# Altium schematic sheet STM32F103C8T6.SchDoc
size A4; SheetNumber: 1; SheetTotal: 1
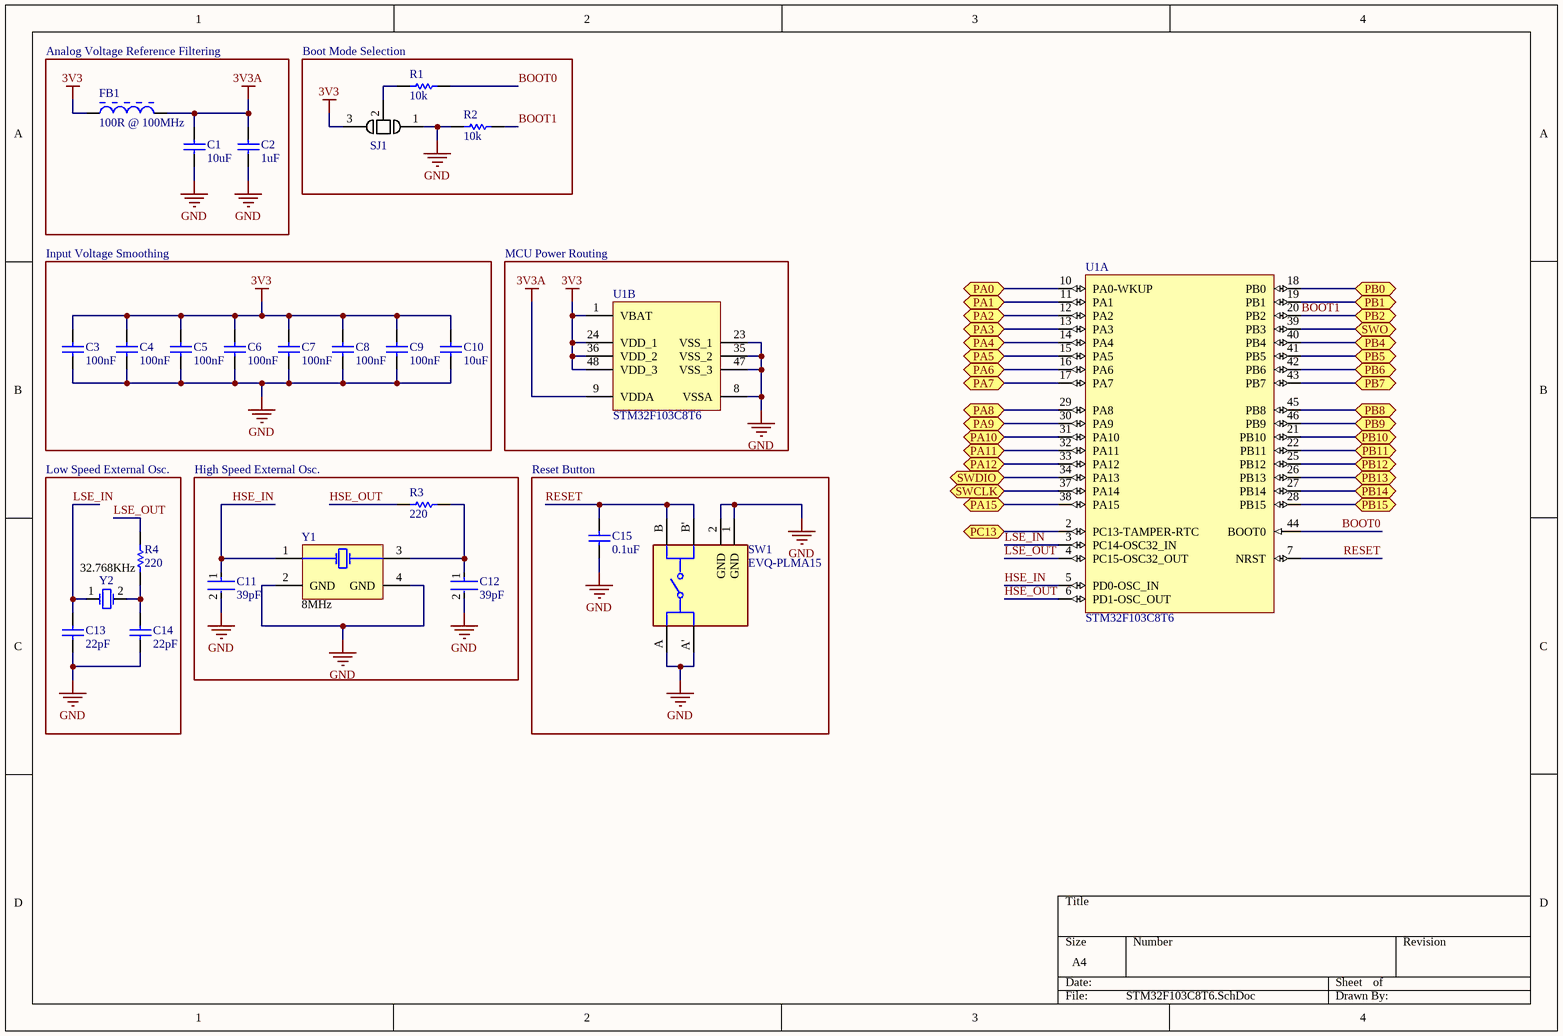
[diagram p0: STM32F103C8T6.SchDoc]

## Parts
C1  10uF  [CAPC3216X180X50LL20T30]
C2  1uF  [CAPC2013X140X50NL20T25]
C3  100nF  [CAPC2013X94X50LL20T25]
C4  100nF  [CAPC2013X94X50LL20T25]
C5  100nF  [CAPC2013X94X50LL20T25]
C6  100nF  [CAPC2013X94X50LL20T25]
C7  100nF  [CAPC2013X94X50LL20T25]
C8  100nF  [CAPC2013X94X50LL20T25]
C9  100nF  [CAPC2013X94X50LL20T25]
C10  10uF  [CAPC3216X180X50LL20T30]
C11  39pF  [FP-CL21-IPC_B]
C12  39pF  [FP-CL21-IPC_B]
C13  22pF  [CAPC2012X88X50ML20T25]
C14  22pF  [CAPC2012X88X50ML20T25]
C15  0.1uF  [CAPC2013X95X45ML10T25]
FB1  100R @ 100MHz  [MURA-BLM18PG_KG-B25-CHIP-2_V1]
R1  10k  [RESC2013X70X40LL20T20]
R2  10k  [RESC2013X70X40LL20T20]
R3  220  [RESC2013X70X40NL20T20]
R4  220  [RESC2013X70X40NL20T20]
SJ1  Switchable Jumper  [6mil Switchable]  (value not drawn)
SW1  EVQ-PLMA15  [FP-EVQ-PLMA15-MFG]
U1  STM32F103C8T6  [STM-LQFP48_L]  (parts A,B of 2)
Y1  8MHz  [ABRA-ABM3B_V]
Y2  32.768KHz  [CMHT-CM315D-2_V]

## Blocks framed on the sheet
Analog Voltage Reference Filtering: C1 C2 FB1
Boot Mode Selection: R1 R2 SJ1
Input Voltage Smoothing: C3-C10
MCU Power Routing: U1
Low Speed External Osc.: C13 C14 R4 Y2
High Speed External Osc.: C11 C12 R3 Y1
Reset Button: C15 SW1

## Ports
PA0 (bidir), PA1 (bidir), PA2 (bidir), PA3 (bidir), PA4 (bidir), PA5 (bidir), PA6 (bidir), PA7 (bidir), PA8 (bidir), PA9 (bidir), PA10 (bidir), PA11 (bidir), PA12 (bidir), PA15 (bidir), PB0 (bidir), PB1 (bidir), PB2 (bidir), PB4 (bidir), PB5 (bidir), PB6 (bidir), PB7 (bidir), PB8 (bidir), PB9 (bidir), PB10 (bidir), PB11 (bidir), PB12 (bidir), PB13 (bidir), PB14 (bidir), PB15 (bidir), PC13 (bidir), SWCLK (bidir), SWDIO (bidir), SWO (bidir)

## Nets
3V3: C3.2 C4.2 C5.2 C6.2 C7.2 C8.2 C9.2 C10.2 FB1.1 SJ1.3 U1.1(VBAT) U1.24(VDD_1) U1.36(VDD_2) U1.48(VDD_3)
3V3A: C1.2 C2.2 FB1.2 U1.9(VDDA)
GND: C1.1 C2.1 C3.1 C4.1 C5.1 C6.1 C7.1 C8.1 C9.1 C10.1 C11.2 C12.2 C13.1 C14.1 C15.2 R2.1 SJ1.1 SW1.1(GND) SW1.2(GND) SW1.A SW1.A' U1.8(VSSA) U1.23(VSS_1) U1.35(VSS_2) U1.47(VSS_3) Y1.2(GND) Y1.4(GND)
BOOT0: R1.2 U1.44(BOOT0)
BOOT1: R2.2 U1.20(PB2) ; port PB2
HSE_IN: C11.1 U1.5(PD0-OSC_IN) Y1.1(X1)
HSE_OUT: R3.2 U1.6(PD1-OSC_OUT)
LSE_IN: C13.2 U1.3(PC14-OSC32_IN) Y2.1
LSE_OUT: R4.2 U1.4(PC15-OSC32_OUT)
PA0: U1.10(PA0-WKUP) ; port PA0
PA1: U1.11(PA1) ; port PA1
PA2: U1.12(PA2) ; port PA2
PA3: U1.13(PA3) ; port PA3
PA4: U1.14(PA4) ; port PA4
PA5: U1.15(PA5) ; port PA5
PA6: U1.16(PA6) ; port PA6
PA7: U1.17(PA7) ; port PA7
PA8: U1.29(PA8) ; port PA8
PA9: U1.30(PA9) ; port PA9
PA10: U1.31(PA10) ; port PA10
PA11: U1.32(PA11) ; port PA11
PA12: U1.33(PA12) ; port PA12
PA15: U1.38(PA15) ; port PA15
PB0: U1.18(PB0) ; port PB0
PB1: U1.19(PB1) ; port PB1
PB4: U1.40(PB4) ; port PB4
PB5: U1.41(PB5) ; port PB5
PB6: U1.42(PB6) ; port PB6
PB7: U1.43(PB7) ; port PB7
PB8: U1.45(PB8) ; port PB8
PB9: U1.46(PB9) ; port PB9
PB10: U1.21(PB10) ; port PB10
PB11: U1.22(PB11) ; port PB11
PB12: U1.25(PB12) ; port PB12
PB13: U1.26(PB13) ; port PB13
PB14: U1.27(PB14) ; port PB14
PB15: U1.28(PB15) ; port PB15
PC13: U1.2(PC13-TAMPER-RTC) ; port PC13
RESET: C15.1 SW1.B SW1.B' U1.7(NRST)
SWCLK: U1.37(PA14) ; port SWCLK
SWDIO: U1.34(PA13) ; port SWDIO
SWO: U1.39(PB3) ; port SWO
NetC12_1: C12.1 R3.1 Y1.3(X2)
NetC14_2: C14.2 R4.1 Y2.2
NetR1_1: R1.1 SJ1.2

## Library data of the parts
C1 C10 = CMP-2000-06107-1: Chip Capacitor, 10 uF, +/- 10%, 25 V, -55 to 85 degC, 1206 (3216 Metric), RoHS, Tape and Reel; Manufacturer: Samsung Electro-Mechanics; Manufacturer Part Number: CL31A106KAHNNNE; Rated Voltage: 25V; Capacitance: 10µF; Dielectric: X5R; Material: Ceramic; Package Reference: 1206; Mounting Technology: SurfaceMount; Package Description: 2-Pin Surface Mount Device, Body 3.2 x 1.6 mm; Manufacturer URL: http://www.samsungsem.com/global/index.jsp; Case Size/Dimension: 1206; Datasheet URL: https://datasheet.ciiva.com/29201/452519-da-01-en-vs-kondensator-1206-29201124.pdf; Tolerance (%): ±10%; Datasheet Version: 11/2010; Supplier 1: Digi-Key; Supplier Part Number 1: 1276-1075-1-ND; RoHS: Yes; Category: Ceramic Capacitors; Stock 1: 396277; Pricing 1: 1=0.24000, 10=0.16500, 100=0.08360, 500=0.05720, 1000=0.05060 (USD); Mount: Surface Mount; Case/Package: 1206; Case Code (Metric): 3216; Case Code (Imperial): 1206; Contact Plating: Tin; Min Operating Temperature: -55°C; Max Operating Temperature: 85°C; Tolerance: 10%; Packaging: Tape and Reel; Voltage Rating (DC): 25V; Voltage Rating: 25V; Voltage: 25V; Length: 3.2mm; Height: 1.6mm; Width: 0.063inch; Depth: 1.6mm; Thickness: 0.071inch; Radiation Hardening: No; Lead Free: Lead Free; ComponentLink1URL: https://datasheet.ciiva.com/25710/cl31a106kahnnne-25710837.pdf?src-supplier=Digi-Key; ComponentLink1Description: https://datasheet.ciiva.com/25710/cl31a106kahnnne-25710837.pdf?src-supplier=Digi-Key; ComponentLink2URL: https://datasheet.ciiva.com/15195/getdatasheetpartid-355210-15195990.pdf?src-supplier=Verical; ComponentLink2Description: https://datasheet.ciiva.com/15195/getdatasheetpartid-355210-15195990.pdf?src-supplier=Verical; ComponentLink3URL: https://datasheet.ciiva.com/29201/452519-da-01-en-vs-kondensator-1206-29201124.pdf?src-supplier=Conrad; ComponentLink3Description: https://datasheet.ciiva.com/29201/452519-da-01-en-vs-kondensator-1206-29201124.pdf?src-supplier=Conrad; Supplier 2: LCSC; Supplier Part Number 2: C9807; Stock 2: 460; Pricing 2: 10=0.04400, 100=0.03140, 300=0.02920, 1000=0.02690, 5000=0.02540, 10000=0.02510, 10=0.04100, 100=0.02930, 300=0.02710, 1000=0.02500, 5000=0.02360, 10000=0.02340, 10=0.21300, 100=0.15210, 300=0.14120, 1000=0.13020, 5000=0.12290, 10000=0.12170, 10=0.19910, 100=0.14220, 300=0.13200, 1000=0.12170, 5000=0.11490, 10000=0.11380, 10=0.02670, 100=0.01910, 300=0.01770, 1000=0.01630, 5000=0.01540, 10000=0.01530, 10=0.02400, 100=0.01720, 300=0.01590, 1000=0.01470, 5000=0.01390, 10000=0.01370, 10=0.23290, 100=0.16630, 300=0.15440, 1000=0.14240, 5000=0.13440, 10000=0.13310, 10=3.22300, 100=2.30210, 300=2.13630, 1000=1.97060, 5000=1.86010, 10000=1.84170, 10=0.12870, 100=0.09190, 300=0.08530, 1000=0.07870, 5000=0.07430, 10000=0.07350, 10=2.09650, 100=1.49740, 300=1.38960, 1000=1.28180, 5000=1.21000, 10000=1.19800, 10=0.28100, 100=0.20070, 300=0.18620, 1000=0.17180, 5000=0.16220, 10000=0.16050, 10=0.04190, 100=0.02990, 300=0.02780, 1000=0.02560, 5000=0.02420, 10000=0.02390, 10=0.03005, 100=0.02146, 300=0.01992, 1000=0.01837, 5000=0.01734, 10000=0.01717 (AUD)
C2 = CMP-2007-03229-1: Part Number: C0805C105J4RACTU; Manufacturer: Kemet; Dielectric Material: Ceramic; Tolerance: 5%; Voltage Rating (DC): 16V; Dielectric: X7R; Supplier 1: Digi-Key; Supplier Part Number 1: 399-8001-1-ND; Manufacturer Part Number: C0805C105J4RACTU; RoHS: Yes; Category: Ceramic Capacitors; Stock 1: 85192; Pricing 1: 1=0.36000, 10=0.25000, 100=0.15030, 500=0.11272, 1000=0.09518 (USD); Mount: Surface Mount; Case/Package: 0805; Number of Pins: 2; Case Code (Imperial): 0805; Case Code (Metric): 2012; Min Operating Temperature: -55°C; Max Operating Temperature: 125°C; Capacitance: 1uF; Packaging: Tape and Reel; Package Quantity: 1; Termination: SMD/SMT; Voltage Rating: 16V; Length: 2mm; Height: 0.9mm; Width: 0.049inch; Thickness: 0.039inch; Depth: 1.25mm; Lead Pitch: 0.75mm; REACH SVHC: No SVHC; ComponentLink1URL: http://components.arrow.com/part/dataview/30748390S8976888N7429?src-supplier=Arrow; ComponentLink1Description: http://components.arrow.com/part/dataview/30748390S8976888N7429?src-supplier=Arrow; ComponentLink2URL: http://components.arrow.com/part/dataview/0323_00070888?src-supplier=Arrow+Europe; ComponentLink2Description: http://components.arrow.com/part/dataview/0323_00070888?src-supplier=Arrow+Europe; ComponentLink3URL: http://www.farnell.com/datasheets/2746093.pdf?src-supplier=Farnell; ComponentLink3Description: http://www.farnell.com/datasheets/2746093.pdf?src-supplier=Farnell; ComponentLink4URL: http://www.mouser.com/ds/2/212/KEM_C1002_X7R_SMD-1102033.pdf?src-supplier=Mouser; ComponentLink4Description: http://www.mouser.com/ds/2/212/KEM_C1002_X7R_SMD-1102033.pdf?src-supplier=Mouser; ComponentLink5URL: http://www.farnell.com/datasheets/2315440.pdf?src-supplier=Farnell; ComponentLink5Description: http://www.farnell.com/datasheets/2315440.pdf?src-supplier=Farnell; ComponentLink6URL: http://capacitoredge.kemet.com/capedge2/DataSheet?pn=C0805C105J4RACTU&src-supplier=Avnet; ComponentLink6Description: http://capacitoredge.kemet.com/capedge2/DataSheet?pn=C0805C105J4RACTU&src-supplier=Avnet; ComponentLink7URL: http://www.farnell.com/datasheets/1828800.pdf?src-supplier=Element14; ComponentLink7Description: http://www.farnell.com/datasheets/1828800.pdf?src-supplier=Element14; ComponentLink8URL: http://www.farnell.com/datasheets/1828800.pdf?src-supplier=Newark; ComponentLink8Description: http://www.farnell.com/datasheets/1828800.pdf?src-supplier=Newark; ComponentLink9URL: http://www.farnell.com/datasheets/2746093.pdf?src-supplier=Element14; ComponentLink9Description: http://www.farnell.com/datasheets/2746093.pdf?src-supplier=Element14; ComponentLink10URL: https://api.kemet.com/component-edge/download/datasheet/C0805C105J4RACTU.pdf?src-supplier=Digi-Key; ComponentLink10Description: https://api.kemet.com/component-edge/download/datasheet/C0805C105J4RACTU.pdf?src-supplier=Digi-Key; ComponentLink11URL: http://www.farnell.com/datasheets/2746093.pdf?src-supplier=Newark; ComponentLink11Description: http://www.farnell.com/datasheets/2746093.pdf?src-supplier=Newark; ComponentLink12URL: http://capacitoredge.kemet.com/capedge2/DataSheet?pn=C0805C105J4RACTU&src-supplier=Avnet+Europe; ComponentLink12Description: http://capacitoredge.kemet.com/capedge2/DataSheet?pn=C0805C105J4RACTU&src-supplier=Avnet+Europe
C3-C9 = CMP-2000-05808-1: Chip Capacitor, 0.1 uF, +/- 5%, 50 V, -55 to 125 degC, 0805 (2012 Metric), RoHS, Tape and Reel; Manufacturer Part Number: 08055C104JAT2A; Case Width: 1.25mm; Case Length: 2.01mm; Case Height: 0.94mm; Capacitance: 0.1uF; Brand: AVX; Type: StandardX7RMLCCs; Dissipation Factor DF: 2.5; Voltage Rating DC: 50V; Temperature Coefficient / Code: +/-15%; Capacitance - pF: 100000pF; Dielectric: X7R; Dielectric Material: Ceramic; Dissipation Factor: 2.5%; Insulation Resistance: 100GR; Dimensions: 1.25mmWx2.01mmLx0.94mmH; Product: GeneralTypeMLCCs; Package Description: 2-Pin Surface Mount Device, Body 2.01 x 1.25 mm; Package / Case: 0805(2012metric); Product Category: MultilayerCeramicCapacitorsMLCC-SMD/SMT; Case Code - mm: 2012; Packaging: Reel; Manufacturer URL: http://www.avx.com/; Operating Temperature Range: -55Cto+125C; Termination Style: SMD/SMT; Maximum Operating Temperature: +125C; Capacitance - nF: 100nF; Case Code - in: 0805; Minimum Operating Temperature: -55C; Factory Pack Quantity: 4000; RoHS: Details; Voltage Rating: 50V; Tolerance: 5%; Package Reference: 0805; Datasheet URL: http://www.farnell.com/datasheets/1679506.pdf; Manufacturer: AVX; Mounting Technology: SurfaceMount; Datasheet Version: 11/2012; Supplier 1: Digi-Key; Supplier Part Number 1: 478-3352-1-ND; Category: Ceramic Capacitors; Stock 1: 1860909; Pricing 1: 1=0.24000, 10=0.16500, 100=0.08360, 500=0.05722, 1000=0.05063 (USD); Mount: Surface Mount,PCB; Case/Package: 0805; Number of Pins: 2; Case Code (Metric): 2012; Case Code (Imperial): 0805; Contact Plating: Tin,Matte; Min Operating Temperature: -55°C; Max Operating Temperature: 125°C; Package Quantity: 1; Voltage Rating (DC): 50V; Termination: SMD/SMT; Voltage: 50V; Length: 2.01mm; Height: 0.94mm; Width: 0.049inch; Thickness: 0.037inch; Depth: 1.25mm; Radiation Hardening: No; REACH SVHC: No SVHC; Lead Free: Lead Free; ComponentLink1URL: https://datasheet.ciiva.com/27054/1929381-27054902.pdf?src-supplier=Jameco; ComponentLink1Description: https://datasheet.ciiva.com/27054/1929381-27054902.pdf?src-supplier=Jameco; ComponentLink2URL: https://datasheet.ciiva.com/150/cx7r-150563.pdf?src-supplier=Digi-Key; ComponentLink2Description: https://datasheet.ciiva.com/150/cx7r-150563.pdf?src-supplier=Digi-Key; ComponentLink3URL: https://datasheet.ciiva.com/150/cx7r-150564.pdf?src-supplier=Digi-Key; ComponentLink3Description: https://datasheet.ciiva.com/150/cx7r-150564.pdf?src-supplier=Digi-Key; ComponentLink4URL: https://datasheet.ciiva.com/150/cx7r-150565.pdf?src-supplier=Digi-Key; ComponentLink4Description: https://datasheet.ciiva.com/150/cx7r-150565.pdf?src-supplier=Digi-Key; ComponentLink5URL: https://datasheet.ciiva.com/28683/cx7r-28683529.pdf?src-supplier=Element14; ComponentLink5Description: https://datasheet.ciiva.com/28683/cx7r-28683529.pdf?src-supplier=Element14; ComponentLink6URL: https://datasheet.ciiva.com/7812/cx7r-7812074.pdf?src-supplier=Element14; ComponentLink6Description: https://datasheet.ciiva.com/7812/cx7r-7812074.pdf?src-supplier=Element14; ComponentLink7URL: https://datasheet.ciiva.com/7812/cx7r-7812075.pdf?src-supplier=Element14; ComponentLink7Description: https://datasheet.ciiva.com/7812/cx7r-7812075.pdf?src-supplier=Element14; ComponentLink8URL: https://datasheet.ciiva.com/15212/getdatasheetpartid-110198-15212571.pdf?src-supplier=Verical; ComponentLink8Description: https://datasheet.ciiva.com/15212/getdatasheetpartid-110198-15212571.pdf?src-supplier=Verical; ComponentLink9URL: https://datasheet.ciiva.com/7812/cx7r-7812076.pdf?src-supplier=Element14; ComponentLink9Description: https://datasheet.ciiva.com/7812/cx7r-7812076.pdf?src-supplier=Element14; ComponentLink10URL: https://datasheet.ciiva.com/14590/70001075-14590237.pdf?src-supplier=Allied+Electronics; ComponentLink10Description: https://datasheet.ciiva.com/14590/70001075-14590237.pdf?src-supplier=Allied+Electronics; ComponentLink11URL: https://datasheet.ciiva.com/16199/cx5r-16199661.pdf?src-supplier=Future+Electronics; ComponentLink11Description: https://datasheet.ciiva.com/16199/cx5r-16199661.pdf?src-supplier=Future+Electronics
C11 C12 = CMP-13271-000816-1: CL21 Series 0805 39pF 50V ±5% Tolerance C0G Multilayer Ceramic Chip Capacitor; Manufacturer: Samsung; Manufacturer Part Number: CL21C390JBANNNC; Temperature Coefficient: 300ppm/°C; Length: 2mm; Voltage Rating: 50V; Height: 0.65mm; Depth: 1.25mm; Width: 0.049inch; Max Operating Temperature: 125°C; Package Quantity: 1; Tolerance: 5%; Mount: Surface Mount; Case/Package: 0805; Radiation Hardening: No; Min Operating Temperature: -55°C; Dielectric: C0G; Material: Ceramic; Packaging: Tape and Reel; Case Code (Imperial): 0805; Voltage: 50V; Capacitance: 39pF; Case Code (Metric): 2012; Thickness: 0.03inch; Supplier 1: Digi-Key; Supplier Part Number 1: 1276-1769-1-ND; RoHS: Yes; Category: Ceramic Capacitors; Stock 1: 76787; Pricing 1: 1=0.10000, 10=0.04300, 50=0.02360, 100=0.01940, 500=0.01382, 1000=0.01086 (USD); Series: CL; Construction: Flat; RoHS Compliant: Yes; ComponentLink1URL: https://datasheet.ciiva.com/15195/getdatasheetpartid-480498-15195959.pdf?src-supplier=Verical; ComponentLink1Description: https://datasheet.ciiva.com/15195/getdatasheetpartid-480498-15195959.pdf?src-supplier=Verical; ComponentLink2URL: https://datasheet.ciiva.com/29199/454441-da-01-en-vs-kondensator-0805-29199687.pdf?src-supplier=Conrad; ComponentLink2Description: https://datasheet.ciiva.com/29199/454441-da-01-en-vs-kondensator-0805-29199687.pdf?src-supplier=Conrad; ComponentLink3URL: https://datasheet.ciiva.com/16428/cl05b104kq5nnnc-16428906.pdf?src-supplier=Future+Electronics; ComponentLink3Description: https://datasheet.ciiva.com/16428/cl05b104kq5nnnc-16428906.pdf?src-supplier=Future+Electronics
C13 C14 = CMP-2007-00048-1: Manufacturer: Kemet; Part Number: C0805C220J5GACTU; Dielectric Material: Ceramic; Tolerance: 5%; Dielectric: C0G; Voltage Rating: 50V; Temperature Coefficient: 30ppm/°C; Supplier 1: Digi-Key; Supplier Part Number 1: 399-1113-1-ND; Manufacturer Part Number: C0805C220J5GACTU; RoHS: Yes; Category: Ceramic Capacitors; Stock 1: 508600; Pricing 1: 1=0.10000, 10=0.07000, 100=0.03100, 500=0.02214, 1000=0.01739 (USD); Mount: PCB,Surface Mount; Case/Package: 0805; Weight: 0.000194oz; Case Code (Metric): 2012; Case Code (Imperial): 0805; Contact Plating: Tin,Matte; Contact Material: Tin; Min Operating Temperature: -55°C; Max Operating Temperature: 125°C; Packaging: Tape and Reel; Capacitance: 22pF; Voltage Rating (DC): 50V; Package Quantity: 1; Termination: SMD/SMT; Voltage: 50V; Length: 2mm; Height: 0.78mm; Width: 1.25mm; Depth: 1.25mm; Thickness: 0.035inch; Radiation Hardening: No; REACH SVHC: No SVHC; Lead Free: Lead Free; ComponentLink1URL: https://datasheet.ciiva.com/7842/1732694-7842250.pdf?src-supplier=Element14; ComponentLink1Description: https://datasheet.ciiva.com/7842/1732694-7842250.pdf?src-supplier=Element14; ComponentLink2URL: https://datasheet.ciiva.com/7842/kem-c1003-c0g-smd-7842569.pdf?src-supplier=Element14; ComponentLink2Description: https://datasheet.ciiva.com/7842/kem-c1003-c0g-smd-7842569.pdf?src-supplier=Element14; ComponentLink3URL: https://datasheet.ciiva.com/28668/1789732-28668761.pdf?src-supplier=Element14; ComponentLink3Description: https://datasheet.ciiva.com/28668/1789732-28668761.pdf?src-supplier=Element14; ComponentLink4URL: https://datasheet.ciiva.com/7842/1372242-7842570.pdf?src-supplier=Element14; ComponentLink4Description: https://datasheet.ciiva.com/7842/1372242-7842570.pdf?src-supplier=Element14; ComponentLink5URL: https://datasheet.ciiva.com/7842/1732694-7842251.pdf?src-supplier=Element14; ComponentLink5Description: https://datasheet.ciiva.com/7842/1732694-7842251.pdf?src-supplier=Element14
C15 = CMP-2000-05017-1: Chip Capacitor, 0.1 uF, +/- 10%, 50 V, 0805 (2012 Metric), RoHS, Tape and Reel; Manufacturer: Samsung Electro-Mechanics; Manufacturer Part Number: CL21B104KBCNNNC; Dielectric: X7R; Capacitance: 100000pF; Rated Voltage: 50V; Material: Ceramic; Tolerance (%): ±10%; Case Size/Dimension: 0805; Datasheet URL: http://www.samsungsem.com/kr/support/product-search/mlcc/__icsFiles/afieldfile/2015/08/14/S_CL21B104KBCNNNC.pdf; Package Reference: 805; Package Description: 2-Pin Surface Mount Device, Body 2 x 1.25 mm; Manufacturer URL: http://www.samsungsem.com/global/index.jsp; Datasheet Version: Jun-15; Supplier 1: LCSC; Supplier Part Number 1: C1711; RoHS: Yes; Category: Ceramic Capacitors; Stock 1: 1573200; Pricing 1: 50=0.01180, 500=0.00860, 1500=0.00810, 5000=0.00750, 25000=0.00710, 50000=0.00710, 50=0.01140, 500=0.00830, 1500=0.00780, 5000=0.00720, 25000=0.00690, 50000=0.00680, 50=0.05850, 500=0.04280, 1500=0.04000, 5000=0.03710, 25000=0.03520, 50000=0.03490, 50=0.05440, 500=0.03980, 1500=0.03710, 5000=0.03450, 25000=0.03280, 50000=0.03250, 50=0.00730, 500=0.00530, 1500=0.00500, 5000=0.00460, 25000=0.00440, 50000=0.00440, 50=0.00670, 500=0.00490, 1500=0.00460, 5000=0.00420, 25000=0.00400, 50000=0.00400, 50=0.06710, 500=0.04910, 1500=0.04580, 5000=0.04260, 25000=0.04040, 50000=0.04010, 50=0.90790, 500=0.66380, 1500=0.61990, 5000=0.57600, 25000=0.54670, 50000=0.54190, 50=0.03570, 500=0.02610, 1500=0.02440, 5000=0.02270, 25000=0.02150, 50000=0.02130, 50=0.64940, 500=0.47480, 1500=0.44340, 5000=0.41200, 25000=0.39110, 50000=0.38760, 50=0.07600, 500=0.05560, 1500=0.05190, 5000=0.04820, 25000=0.04580, 50000=0.04530, 50=0.01170, 500=0.00860, 1500=0.00800, 5000=0.00750, 25000=0.00710, 50000=0.00700, 50=0.00866, 500=0.00633, 1500=0.00591, 5000=0.00549, 25000=0.00521, 50000=0.00517 (AUD); Mount: Surface Mount; Case/Package: 0805; Case Code (Metric): 2012; Case Code (Imperial): 0805; Contact Plating: Tin; Min Operating Temperature: -55°C; Max Operating Temperature: 125°C; Tolerance: 10%; Packaging: Tape and Reel; Voltage Rating: 50V; Voltage Rating (DC): 50V; Voltage: 50V; Length: 2mm; Height: 0.85mm; Width: 0.049inch; Depth: 1.25mm; Thickness: 0.037inch; Radiation Hardening: No; Lead Free: Lead Free; ComponentLink1URL: https://datasheet.ciiva.com/25710/cl21b104kbcnnnc-25710182.pdf?src-supplier=Digi-Key; ComponentLink1Description: https://datasheet.ciiva.com/25710/cl21b104kbcnnnc-25710182.pdf?src-supplier=Digi-Key; ComponentLink2URL: https://datasheet.ciiva.com/29199/454152-da-01-en-vs-kondensator-0805-29199814.pdf?src-supplier=Conrad; ComponentLink2Description: https://datasheet.ciiva.com/29199/454152-da-01-en-vs-kondensator-0805-29199814.pdf?src-supplier=Conrad; Supplier 2: Digi-Key; Supplier Part Number 2: 1276-1003-1-ND; Stock 2: 2187571; Pricing 2: 1=0.10000, 10=0.04700, 50=0.02560, 100=0.02100, 500=0.01498, 1000=0.01177 (USD)
FB1 = CMP-0686-00557-6: Chip Ferrite Bead for Power Lines, 120 Ohm, 2000 mA, -55 to 125 degC, 1.6 x 0.8 x 0.95 mm SMD, Tape and Reel; PartNumber: BLM18PG121SN1D; Manufacturer: Murata; Impedance (at 100 MHz): 120 Ohm +/- 25%; Rated Current: 2000 mA; DC Resistance: 0.05 Ohm Max.; Material: Steel,Ferrite; Impedance: 120R; Current Rating: 2A; DC Resistance (DCR): 50mR; Number of Lines: 1; Tolerance: 25%; Shielding: Unshielded; DatasheetVersion: 08/2013; PackageDescription: 2-Pin Chip, Body 1.6 x 0.8 mm; ComponentLink3URL: http://www.murata.com/products/catalog/pdf/c31e.pdf; ComponentLink1URL: http://www.murata.com/; ComponentLink2Description: Datasheet; Mounting Technology: Surface Mount; ComponentLink1Description: Manufacturer URL; PackageReference: BLM18_H950-2; ComponentLink2URL: http://www.murata.com/products/catalog/pdf/c31e.pdf; ComponentLink3Description: Package Specification; Packing: Tape and Reel; Operating Temperature Range: -55 to 125 degC; Supplier 1: LCSC; Supplier Part Number 1: C14709; Manufacturer Part Number: BLM18PG121SN1D; RoHS: Yes; Category: Inductors; Stock 1: 101650; Pricing 1: 50=0.01390, 500=0.01020, 1500=0.00950, 5000=0.00880, 25000=0.00850, 50000=0.00840, 50=0.01320, 500=0.00970, 1500=0.00910, 5000=0.00840, 25000=0.00810, 50000=0.00800, 50=0.06740, 500=0.04940, 1500=0.04610, 5000=0.04280, 25000=0.04130, 50000=0.04060, 50=0.06270, 500=0.04600, 1500=0.04290, 5000=0.03980, 25000=0.03850, 50000=0.03780, 50=0.00840, 500=0.00620, 1500=0.00580, 5000=0.00540, 25000=0.00520, 50000=0.00510, 50=0.00770, 500=0.00560, 1500=0.00530, 5000=0.00490, 25000=0.00470, 50000=0.00460, 50=0.07670, 500=0.05620, 1500=0.05250, 5000=0.04870, 25000=0.04700, 50000=0.04620, 50=1.04540, 500=0.76650, 1500=0.71530, 5000=0.66410, 25000=0.64130, 50000=0.63000, 50=0.04110, 500=0.03010, 1500=0.02810, 5000=0.02610, 25000=0.02520, 50000=0.02480, 50=0.78020, 500=0.57200, 1500=0.53390, 5000=0.49560, 25000=0.47870, 50000=0.47020, 50=0.08860, 500=0.06500, 1500=0.06070, 5000=0.05630, 25000=0.05440, 50000=0.05340, 50=0.01350, 500=0.00990, 1500=0.00930, 5000=0.00860, 25000=0.00830, 50000=0.00820, 50=0.00989, 500=0.00725, 1500=0.00677, 5000=0.00628, 25000=0.00607, 50000=0.00596 (AUD); Case/Package: 0603; Number of Pins: 2; Case Code (Metric): 1608; Case Code (Imperial): 0603; Core Material: Ferrite; Min Operating Temperature: -55°C; Max Operating Temperature: 125°C; Package Quantity: 1; Packaging: Tape and Reel; Max DC Current: 2A; Termination: SMD/SMT; Test Frequency: 100MHz; Frequency: 100MHz; Max Current Rating: 2A; DC Current: 2A; Number of Circuits: 1; Length: 1.6mm; Height: 0.8mm; Width: 0.8mm; Depth: 0.8mm; Radiation Hardening: No; REACH SVHC: No SVHC; Lead Free: Lead Free; ComponentLink4URL: https://datasheet.ciiva.com/5709/1740433-5709171.pdf?src-supplier=Farnell; ComponentLink4Description: https://datasheet.ciiva.com/5709/1740433-5709171.pdf?src-supplier=Farnell; ComponentLink5URL: https://datasheet.ciiva.com/11799/0900766b81275ca5-11799546.pdf?src-supplier=RSComponents; ComponentLink5Description: https://datasheet.ciiva.com/11799/0900766b81275ca5-11799546.pdf?src-supplier=RSComponents; ComponentLink6URL: https://datasheet.ciiva.com/19454/1845013-19454715.pdf?src-supplier=Jameco; ComponentLink6Description: https://datasheet.ciiva.com/19454/1845013-19454715.pdf?src-supplier=Jameco; ComponentLink7URL: https://datasheet.ciiva.com/3854/5emiapbde-1-3854039.pdf?src-supplier=Arrow+Electronics; ComponentLink7Description: https://datasheet.ciiva.com/3854/5emiapbde-1-3854039.pdf?src-supplier=Arrow+Electronics; ComponentLink8URL: https://datasheet.ciiva.com/29347/442365-da-01-en-chip-drossel-0603-120r-2000ma-1-6x0-8mm-29347911.pdf?src-supplier=Conrad; ComponentLink8Description: https://datasheet.ciiva.com/29347/442365-da-01-en-chip-drossel-0603-120r-2000ma-1-6x0-8mm-29347911.pdf?src-supplier=Conrad; ComponentLink9URL: https://datasheet.ciiva.com/3081/l0110s0100blm18p-3081632.pdf?src-supplier=Avnet; ComponentLink9Description: https://datasheet.ciiva.com/3081/l0110s0100blm18p-3081632.pdf?src-supplier=Avnet; ComponentLink10URL: https://datasheet.ciiva.com/8021/1740433-8021493.pdf?src-supplier=Element14; ComponentLink10Description: https://datasheet.ciiva.com/8021/1740433-8021493.pdf?src-supplier=Element14; ComponentLink11URL: https://datasheet.ciiva.com/6212/l0110s0100blm18p-6212502.pdf?src-supplier=Digi-Key; ComponentLink11Description: https://datasheet.ciiva.com/6212/l0110s0100blm18p-6212502.pdf?src-supplier=Digi-Key; ComponentLink12URL: https://datasheet.ciiva.com/8021/1740433-8021494.pdf?src-supplier=Element14; ComponentLink12Description: https://datasheet.ciiva.com/8021/1740433-8021494.pdf?src-supplier=Element14; ComponentLink13URL: https://datasheet.ciiva.com/6212/l0110s0100blm18p-6212504.pdf?src-supplier=Digi-Key; ComponentLink13Description: https://datasheet.ciiva.com/6212/l0110s0100blm18p-6212504.pdf?src-supplier=Digi-Key; ComponentLink14URL: https://datasheet.ciiva.com/14122/blm-series-eng-tds-14122905.pdf?src-supplier=Distrelec; ComponentLink14Description: https://datasheet.ciiva.com/14122/blm-series-eng-tds-14122905.pdf?src-supplier=Distrelec; ComponentLink15URL: https://datasheet.ciiva.com/25903/l0110s0100blm18p-25903483.pdf?src-supplier=Avnet+Europe; ComponentLink15Description: https://datasheet.ciiva.com/25903/l0110s0100blm18p-25903483.pdf?src-supplier=Avnet+Europe; ComponentLink16URL: https://datasheet.ciiva.com/41449/001172297-da-01-en-drossel-0603-120r-1-6x0-8mm-4000st-41449659.pdf?src-supplier=Conrad; ComponentLink16Description: https://datasheet.ciiva.com/41449/001172297-da-01-en-drossel-0603-120r-1-6x0-8mm-4000st-41449659.pdf?src-supplier=Conrad; Supplier 2: Digi-Key; Supplier Part Number 2: 490-1037-1-ND; Stock 2: 652829; Pricing 2: 1=0.10000, 10=0.07600, 25=0.06920, 50=0.06220, 100=0.04550, 250=0.03312, 500=0.03036, 1000=0.02622 (USD)
R1 R2 = CMP-2001-00337-1: Part Number: ERJ-6GEYJ103V; Manufacturer: Panasonic; Resistance: 10kR; Power Rating: 125mW; Voltage Rating: 150V; Temperature Coefficient: 200ppm/°C; Tolerance: 5%; Supplier 1: Digi-Key; Supplier Part Number 1: P10KACT-ND; Manufacturer Part Number: ERJ-6GEYJ103V; RoHS: Yes; Category: Chip SMD Resistors; Stock 1: 4163299; Pricing 1: 1=0.10000, 10=0.05400, 100=0.02210, 1000=0.00991, 2500=0.00860 (USD); Mount: Surface Mount; Case/Package: 0805; Case Code (Metric): 2012; Case Code (Imperial): 0805; Contact Plating: Tin; Min Operating Temperature: -55°C; Max Operating Temperature: 155°C; Packaging: Tape and Reel; Termination: SMD/SMT; Composition: Thick Film; Voltage Rating (DC): 150V; Package Quantity: 5000; Number of Terminations: 2; Military Standard: Not; Max Power Dissipation: 125mW; Features: Automotive AEC-Q200; Length: 2mm; Height: 0.6mm; Width: 0.049inch; Depth: 1.25mm; Radiation Hardening: No; Lead Free: Lead Free; REACH SVHC: No SVHC; ComponentLink1URL: https://datasheet.ciiva.com/11821/0900766b80f806dd-11821504.pdf?src-supplier=RSComponents; ComponentLink1Description: https://datasheet.ciiva.com/11821/0900766b80f806dd-11821504.pdf?src-supplier=RSComponents; ComponentLink2URL: https://datasheet.ciiva.com/22785/1500035-22785957.pdf?src-supplier=Farnell; ComponentLink2Description: https://datasheet.ciiva.com/22785/1500035-22785957.pdf?src-supplier=Farnell; ComponentLink3URL: https://datasheet.ciiva.com/30128/4aoa0000ce1-30128839.pdf?src-supplier=Onlinecomponents.com; ComponentLink3Description: https://datasheet.ciiva.com/30128/4aoa0000ce1-30128839.pdf?src-supplier=Onlinecomponents.com; ComponentLink4URL: https://datasheet.ciiva.com/16428/aoa0000ce1-16428072.pdf?src-supplier=Future+Electronics; ComponentLink4Description: https://datasheet.ciiva.com/16428/aoa0000ce1-16428072.pdf?src-supplier=Future+Electronics; ComponentLink5URL: https://datasheet.ciiva.com/16782/70255313-16782712.pdf?src-supplier=Allied+Electronics; ComponentLink5Description: https://datasheet.ciiva.com/16782/70255313-16782712.pdf?src-supplier=Allied+Electronics; ComponentLink6URL: https://datasheet.ciiva.com/43460/1500035-43460125.pdf?src-supplier=Farnell; ComponentLink6Description: https://datasheet.ciiva.com/43460/1500035-43460125.pdf?src-supplier=Farnell; ComponentLink7URL: https://datasheet.ciiva.com/17212/aoa0000ce1-17212110.pdf?src-supplier=Avnet+Europe; ComponentLink7Description: https://datasheet.ciiva.com/17212/aoa0000ce1-17212110.pdf?src-supplier=Avnet+Europe; ComponentLink8URL: https://datasheet.ciiva.com/16787/70255313-16787775.pdf?src-supplier=Allied+Electronics; ComponentLink8Description: https://datasheet.ciiva.com/16787/70255313-16787775.pdf?src-supplier=Allied+Electronics; ComponentLink9URL: https://datasheet.ciiva.com/46386/1500035-46386469.pdf?src-supplier=Element14; ComponentLink9Description: https://datasheet.ciiva.com/46386/1500035-46386469.pdf?src-supplier=Element14; ComponentLink10URL: https://datasheet.ciiva.com/9117/aoa0000ce1-9117371.pdf?src-supplier=Avnet; ComponentLink10Description: https://datasheet.ciiva.com/9117/aoa0000ce1-9117371.pdf?src-supplier=Avnet; ComponentLink11URL: https://datasheet.ciiva.com/28514/1678796-28514236.pdf?src-supplier=Element14; ComponentLink11Description: https://datasheet.ciiva.com/28514/1678796-28514236.pdf?src-supplier=Element14; Supplier 2: LCSC; Supplier Part Number 2: C180849; Stock 2: 85650; Pricing 2: 50=0.01010, 500=0.00750, 1500=0.00700, 5000=0.00650, 25000=0.00630, 50000=0.00620, 50=0.00940, 500=0.00700, 1500=0.00650, 5000=0.00600, 25000=0.00580, 50000=0.00570, 50=0.04910, 500=0.03630, 1500=0.03390, 5000=0.03150, 25000=0.03050, 50000=0.03000, 50=0.04600, 500=0.03390, 1500=0.03170, 5000=0.02950, 25000=0.02850, 50000=0.02800, 50=0.00620, 500=0.00460, 1500=0.00430, 5000=0.00400, 25000=0.00380, 50000=0.00380, 50=0.00550, 500=0.00410, 1500=0.00380, 5000=0.00350, 25000=0.00340, 50000=0.00340, 50=0.05370, 500=0.03960, 1500=0.03700, 5000=0.03450, 25000=0.03330, 50000=0.03280, 50=0.73950, 500=0.54590, 1500=0.51040, 5000=0.47480, 25000=0.45900, 50000=0.45120, 50=0.02970, 500=0.02190, 1500=0.02050, 5000=0.01900, 25000=0.01840, 50000=0.01810, 50=0.48310, 500=0.35660, 1500=0.33340, 5000=0.31020, 25000=0.29980, 50000=0.29470, 50=0.06470, 500=0.04780, 1500=0.04470, 5000=0.04160, 25000=0.04020, 50000=0.03950, 50=0.00970, 500=0.00710, 1500=0.00670, 5000=0.00620, 25000=0.00600, 50000=0.00590, 50=0.00693, 500=0.00511, 1500=0.00478, 5000=0.00445, 25000=0.00430, 50000=0.00423 (AUD)
R3 R4 = CMP-2001-00044-1: Part Number: ERJ6ENF2200V; Manufacturer: Panasonic; Manufacturer Part Number: ERJ-6ENF2200V; Resistance: 220R; Tolerance: 1%; Temperature Coefficient: 100ppm/°C; Power Rating: 125mW; Voltage Rating: 150V; Supplier 1: Digi-Key; Supplier Part Number 1: P220CCT-ND; RoHS: Yes; Category: Chip SMD Resistors; Stock 1: 108553; Pricing 1: 1=0.10000, 10=0.07200, 100=0.02750, 1000=0.01210, 2500=0.01045 (USD); Mount: Surface Mount; Case/Package: 0805; Number of Pins: 2; Case Code (Imperial): 0805; Case Code (Metric): 2012; Contact Plating: Tin; Min Operating Temperature: -55°C; Max Operating Temperature: 155°C; Packaging: Tape and Reel; Composition: Thick Film; Termination: SMD/SMT; Voltage Rating (DC): 150V; Package Quantity: 1; Number of Terminations: 2; Max Power Dissipation: 125mW; Military Standard: Not; Features: Automotive AEC-Q200; Length: 2mm; Height: 0.6mm; Width: 1.2mm; Depth: 1.25mm; Radiation Hardening: No; Lead Free: Lead Free; REACH SVHC: No SVHC; ComponentLink1URL: https://datasheet.ciiva.com/11821/0900766b80f80784-11821561.pdf?src-supplier=RSComponents; ComponentLink1Description: https://datasheet.ciiva.com/11821/0900766b80f80784-11821561.pdf?src-supplier=RSComponents; ComponentLink2URL: https://datasheet.ciiva.com/26914/getdatasheetpartid-123856-26914677.pdf?src-supplier=Verical; ComponentLink2Description: https://datasheet.ciiva.com/26914/getdatasheetpartid-123856-26914677.pdf?src-supplier=Verical; ComponentLink3URL: https://datasheet.ciiva.com/43511/aoa0000ce2-43511461.pdf?src-supplier=Onlinecomponents.com; ComponentLink3Description: https://datasheet.ciiva.com/43511/aoa0000ce2-43511461.pdf?src-supplier=Onlinecomponents.com; ComponentLink4URL: https://datasheet.ciiva.com/7887/426256-7887031.pdf?src-supplier=Element14; ComponentLink4Description: https://datasheet.ciiva.com/7887/426256-7887031.pdf?src-supplier=Element14; ComponentLink5URL: https://datasheet.ciiva.com/28568/1678782-28568983.pdf?src-supplier=Element14; ComponentLink5Description: https://datasheet.ciiva.com/28568/1678782-28568983.pdf?src-supplier=Element14; ComponentLink6URL: https://datasheet.ciiva.com/16771/70260748-16771368.pdf?src-supplier=Allied+Electronics; ComponentLink6Description: https://datasheet.ciiva.com/16771/70260748-16771368.pdf?src-supplier=Allied+Electronics; ComponentLink7URL: https://datasheet.ciiva.com/16784/70260748-16784746.pdf?src-supplier=Allied+Electronics; ComponentLink7Description: https://datasheet.ciiva.com/16784/70260748-16784746.pdf?src-supplier=Allied+Electronics; ComponentLink8URL: https://datasheet.ciiva.com/22668/1678782-22668331.pdf?src-supplier=Element14; ComponentLink8Description: https://datasheet.ciiva.com/22668/1678782-22668331.pdf?src-supplier=Element14; ComponentLink9URL: https://datasheet.ciiva.com/9184/aoa0000ce2-9184302.pdf?src-supplier=Avnet; ComponentLink9Description: https://datasheet.ciiva.com/9184/aoa0000ce2-9184302.pdf?src-supplier=Avnet; Supplier 2: LCSC; Supplier Part Number 2: C413269; Stock 2: 1550; Pricing 2: 50=0.01470, 500=0.01080, 1500=0.01000, 5000=0.00930, 25000=0.00900, 50000=0.00880, 50=0.01370, 500=0.01000, 1500=0.00940, 5000=0.00870, 25000=0.00840, 50000=0.00820, 50=0.07160, 500=0.05230, 1500=0.04880, 5000=0.04530, 25000=0.04370, 50000=0.04290, 50=0.06700, 500=0.04900, 1500=0.04570, 5000=0.04240, 25000=0.04090, 50000=0.04020, 50=0.00900, 500=0.00660, 1500=0.00610, 5000=0.00570, 25000=0.00550, 50000=0.00540, 50=0.00810, 500=0.00590, 1500=0.00550, 5000=0.00510, 25000=0.00490, 50000=0.00480, 50=0.07830, 500=0.05720, 1500=0.05330, 5000=0.04950, 25000=0.04780, 50000=0.04690, 50=1.07840, 500=0.78820, 1500=0.73490, 5000=0.68170, 25000=0.65790, 50000=0.64620, 50=0.04320, 500=0.03160, 1500=0.02950, 5000=0.02730, 25000=0.02640, 50000=0.02590, 50=0.70440, 500=0.51490, 1500=0.48010, 5000=0.44530, 25000=0.42980, 50000=0.42210, 50=0.09440, 500=0.06900, 1500=0.06430, 5000=0.05970, 25000=0.05760, 50000=0.05660, 50=0.01410, 500=0.01030, 1500=0.00960, 5000=0.00890, 25000=0.00860, 50000=0.00840, 50=0.01010, 500=0.00738, 1500=0.00688, 5000=0.00638, 25000=0.00616, 50000=0.00605 (AUD)
SJ1 = Switchable Jumper: Switchable Solder Jumper to choose between two connections.
SW1 = CMP-05618-000006-1: SWITCH TACTILE SPST-NO 0.02A 15V; Manufacturer: Panasonic Electronic Components; Operating Force: 2.6N; Contact Resistance: 50mΩ; Contact Current Rating: 20mA; Electromechanical Life: 200000Cycles; Illumination Type: Non-Illuminated,Illuminated; Switch Function: Off-Mom; Actuator Type: Standard; Switch Travel: 0.25mm; Insulation Resistance: 50MR; Actuator Length: 0.3mm; Throw Configuration: SPST-NO; Automotive: No; Digikey Description: SWITCH TACTILE SPST-NO 0.02A 15V; Device Class L3: Tactile Switches; Device Class L2: Switches; Temperature Range Low: -20°C; ComponentLink2Description: Datasheet; RoHS: TRUE; Mount: Surface Mount; Package: 0; Height: 1.7mm; Octopart: https://octopart.com/evq-plma15-panasonic-39850235; Temperature Range High: +70°C; Device Class L1: Electromechanical; Category: Switch; Mouser Description: Tactile Switches FLAT ACT 2.6NF 4.6x3.4x1.5mm; Voltage Rating Dc: 15V; Manufacturer Part Number: EVQ-PLMA15; ComponentLink2URL: https://datasheet.ciiva.com/8164/atv0000ce2-8164994.pdf; Lead Free: Yes; Temperature: -20°C to +70°C; Supplier 1: Digi-Key; Supplier Part Number 1: P8047SCT-ND; Stock 1: 10270; Pricing 1: 1=0.40000, 10=0.38500, 25=0.36200, 100=0.31440, 250=0.28520, 500=0.26532, 1000=0.23879, 2500=0.22420 (USD); Mechanical Life: 200000Cycles; Contact Plating: Gold,Silver; Min Operating Temperature: -20°C; Max Operating Temperature: 70°C; Packaging: Tape and Reel; Termination: J-Bend; Package Quantity: 1; Max Voltage Rating (DC): 15V; Orientation: Straight; Voltage Rating (DC): 15V; Current Rating: 20mA; Max Current Rating: 20mA; Electrical Life: 200000Cycles; Voltage Rating: 15V; Length: 4.9mm; Depth: 4.9mm; Width: 4.9mm; Radiation Hardening: No; REACH SVHC: No SVHC; ComponentLink1URL: https://datasheet.ciiva.com/8164/atv0000ce2-8164994.pdf?src-supplier=Avnet; ComponentLink1Description: https://datasheet.ciiva.com/8164/atv0000ce2-8164994.pdf?src-supplier=Avnet; ComponentLink3URL: https://datasheet.ciiva.com/16205/atk0000ce3-16205767.pdf?src-supplier=Future+Electronics; ComponentLink3Description: https://datasheet.ciiva.com/16205/atk0000ce3-16205767.pdf?src-supplier=Future+Electronics; ComponentLink4URL: https://datasheet.ciiva.com/17065/70270715-17065721.pdf?src-supplier=Allied+Electronics; ComponentLink4Description: https://datasheet.ciiva.com/17065/70270715-17065721.pdf?src-supplier=Allied+Electronics; ComponentLink5URL: https://datasheet.ciiva.com/2899/atk0000ce3-2899834.pdf?src-supplier=Digi-Key; ComponentLink5Description: https://datasheet.ciiva.com/2899/atk0000ce3-2899834.pdf?src-supplier=Digi-Key; ComponentLink6URL: https://datasheet.ciiva.com/2899/atk0000ce3-2899835.pdf?src-supplier=Digi-Key; ComponentLink6Description: https://datasheet.ciiva.com/2899/atk0000ce3-2899835.pdf?src-supplier=Digi-Key; ComponentLink7URL: https://datasheet.ciiva.com/2899/atk0000ce3-2899836.pdf?src-supplier=Digi-Key; ComponentLink7Description: https://datasheet.ciiva.com/2899/atk0000ce3-2899836.pdf?src-supplier=Digi-Key; ComponentLink8URL: https://datasheet.ciiva.com/26827/getdatasheetpartid-51835-26827884.pdf?src-supplier=Verical; ComponentLink8Description: https://datasheet.ciiva.com/26827/getdatasheetpartid-51835-26827884.pdf?src-supplier=Verical; Supplier 2: LCSC; Supplier Part Number 2: C128538; Stock 2: 6341; Pricing 2: 1=0.21800, 10=0.16260, 30=0.15240, 100=0.14220, 500=0.13770, 1000=0.13540, 1=0.20310, 10=0.15140, 30=0.14190, 100=0.13250, 500=0.12830, 1000=0.12620, 1=1.05930, 10=0.78990, 30=0.74040, 100=0.69100, 500=0.66900, 1000=0.65800, 1=0.99140, 10=0.73930, 30=0.69290, 100=0.64670, 500=0.62610, 1000=0.61590, 1=0.13300, 10=0.09920, 30=0.09290, 100=0.08670, 500=0.08400, 1000=0.08260, 1=0.11920, 10=0.08890, 30=0.08330, 100=0.07780, 500=0.07530, 1000=0.07410, 1=1.15780, 10=0.86330, 30=0.80920, 100=0.75520, 500=0.73120, 1000=0.71920, 1=15.95070, 10=11.89420, 30=11.14850, 100=10.40450, 500=10.07330, 1000=9.90850, 1=0.63950, 10=0.47690, 30=0.44700, 100=0.41720, 500=0.40390, 1000=0.39730, 1=10.41900, 10=7.76930, 30=7.28220, 100=6.79620, 500=6.57990, 1000=6.47220, 1=1.39620, 10=1.04110, 30=0.97580, 100=0.91070, 500=0.88170, 1000=0.86730, 1=0.20830, 10=0.15540, 30=0.14560, 100=0.13590, 500=0.13160, 1000=0.12940, 1=0.14939, 10=0.11140, 30=0.10441, 100=0.09744, 500=0.09434, 1000=0.09280 (AUD)
U1 = CMP-0237-00215-3: ARM Cortex-M3 32-bit MCU, 64 KB Flash, 20 KB Internal RAM, 37 I/Os, 48-pin LQFP, -40 to 85 degC, Tray; Manufacturer: STMicroelectronics; Supply Voltage(Vcc) min (V): 2; Internal RAM Size (kB): 20; FLASH Size (Prog) (kB): 64; A/D Converter: 2x12-bit (10 Channel); I/Os (High Current): 37; Operating Frequency(F) (Processor speed) (MHz): 72; RAM Size: 20KB; Frequency: 72MHz; Max Power Dissipation: 363mW; Interface: I2C,SPI,USB,CAN,IrDA,UART,USART,LIN; Number of Timers/Counters: 4; Max Supply Voltage: 3.6V; Number of ADC Channels: 10; Density: 64KB; Min Supply Voltage: 2V; Number of Programmable I/O: 48; Data Bus Width: 32b; Number of Bits: 32; Watchdog Timer: Yes; Peripherals: POR,PWM,WDT,DMA,Temp Sensor,I2C; Number of PWM Channels: 1; Core: ARM Cortex-M3; ComponentLink3Description: Package Specification; Mounting Technology: Surface Mount; PartNumber: STM32F103C8T6; PackageReference: LQFP48; Packing: Tray; ComponentLink3URL: http://www.st.com/st-web-ui/static/active/en/resource/technical/document/datasheet/DM00058181.pdf; DatasheetVersion: Rev. 16; ComponentLink1URL: http://www.st.com/web/en/home.html; PackageVersion: Rev. 6, 06/2013; ComponentLink2URL: http://www.st.com/st-web-ui/static/active/en/resource/technical/document/datasheet/CD00161566.pdf; ComponentLink1Description: Manufacturer URL; ComponentLink2Description: Datasheet; PackageDescription: 48-Pin Low Profile Quad Flat Package, 7 x 7 mm Body, 0.5 mm Pitch; Supplier 1: LCSC; Supplier Part Number 1: C8734; Manufacturer Part Number: STM32F103C8T6; RoHS: Yes; Category: Microcontrollers; Stock 1: 13855; Pricing 1: 1=10.23680, 10=8.19880, 30=7.68760, 100=7.02530, 500=6.72080, 1000=6.66970, 1=10.08560, 10=8.07770, 30=7.57410, 100=6.92150, 500=6.62160, 1000=6.57120, 1=51.20320, 10=41.00960, 30=38.45280, 100=35.13970, 500=33.61690, 1000=33.36110, 1=48.63680, 10=38.95410, 30=36.52540, 100=33.37840, 500=31.93190, 1000=31.68900, 1=6.53930, 10=5.23750, 30=4.91090, 100=4.48780, 500=4.29330, 1000=4.26070, 1=5.74680, 10=4.60270, 30=4.31580, 100=3.94390, 500=3.77300, 1000=3.74430, 1=61.46900, 10=49.23160, 30=46.16220, 100=42.18490, 500=40.35670, 1000=40.04970, 1=831.11010, 10=665.65130, 30=624.15030, 100=570.37400, 500=545.65580, 1000=541.50470, 1=32.05060, 10=25.66990, 30=24.06940, 100=21.99560, 500=21.04240, 1000=20.88230, 1=584.41260, 10=468.06670, 30=438.88440, 100=401.07050, 500=383.68940, 1000=380.77040, 1=66.04040, 10=52.89300, 30=49.59530, 100=45.32220, 500=43.35810, 1000=43.02820, 1=10.50670, 10=8.41500, 30=7.89040, 100=7.21050, 500=6.89810, 1000=6.84560, 1=7.92840, 10=6.35000, 30=5.95410, 100=5.44110, 500=5.20530, 1000=5.16570 (AUD); Case/Package: LQFP; Number of Pins: 48; Min Operating Temperature: -40°C; Max Operating Temperature: 85°C; Packaging: Tray; Package Quantity: 250; Number of I/Os: 37; Oscillator Type: Internal; Memory Type: FLASH; Max Frequency: 72MHz; Memory Size: 64KB; Core Architecture: ARM; Termination: SMD/SMT; Number of SPI Channels: 2; Number of I2C Channels: 2; Address Bus Width: 32b; Length: 7mm; Width: 7.2mm; Height: 1.45mm; Radiation Hardening: No; Lead Free: Lead Free; REACH SVHC: No SVHC; ComponentLink4URL: https://datasheet.ciiva.com/15122/getdatasheetpartid-69880-15122076.pdf?src-supplier=Verical; ComponentLink4Description: https://datasheet.ciiva.com/15122/getdatasheetpartid-69880-15122076.pdf?src-supplier=Verical; ComponentLink5URL: https://datasheet.ciiva.com/26816/stm32f103c8t6-26816902.pdf?src-supplier=IIIC; ComponentLink5Description: https://datasheet.ciiva.com/26816/stm32f103c8t6-26816902.pdf?src-supplier=IIIC; ComponentLink6URL: https://datasheet.ciiva.com/16210/cd00161566-16210248.pdf?src-supplier=Future+Electronics; ComponentLink6Description: https://datasheet.ciiva.com/16210/cd00161566-16210248.pdf?src-supplier=Future+Electronics; ComponentLink7URL: https://datasheet.ciiva.com/14100/pustm-arm-microcont-stm32f103-en-14100508.pdf?src-supplier=Distrelec; ComponentLink7Description: https://datasheet.ciiva.com/14100/pustm-arm-microcont-stm32f103-en-14100508.pdf?src-supplier=Distrelec; ComponentLink8URL: https://datasheet.ciiva.com/8054/1730126-8054942.pdf?src-supplier=Element14; ComponentLink8Description: https://datasheet.ciiva.com/8054/1730126-8054942.pdf?src-supplier=Element14; ComponentLink9URL: https://datasheet.ciiva.com/48687/001075658-da-01-en-mcu-64kb-mem-stm32f103c8t6-lqfp-48-stm-48687589.pdf?src-supplier=Conrad; ComponentLink9Description: https://datasheet.ciiva.com/48687/001075658-da-01-en-mcu-64kb-mem-stm32f103c8t6-lqfp-48-stm-48687589.pdf?src-supplier=Conrad
Y1 = CMP-1688-00002-1: Ceramic SMD Crystal, 8 MHz, +/- 20 ppm, 200 Ohm, -20 to 70 degC, 4-Pin SMD, RoHS, Tape and Reel; Manufacturer: Abracon; Manufacturer Part Number: ABM3B-8.000MHZ-B2-T; Max Supply Voltage: 45 V; Outputs: 4; Min Supply Voltage: 8.2 V; Output Voltage: 3.3 V; Switching Frequency: 30 KHz; Output Current: 1.8 A; Load Capacitance: 18pF; Frequency Tolerance: 20ppm; Frequency Stability: 50ppm; ESR (Equivalent Series Resistance): 200R; Packaging: Rail/Tube; ComponentLink2Description: Datasheet; REACH SVHC: No SVHC; ComponentLink1URL: http://www.abracon.com/; PackageReference: ABM3B; Weight: 0.004233 oz; Height: 1.05 mm; ComponentLink2URL: http://www.abracon.com/Resonators/abm3b.pdf; Mount: Surface Mount; Min Operating Temperature: -40 degC; Max Operating Temperature: 85 degC; Package Quantity: 50; PackageDescription: 4-Pin Surface Mount Device, Body 5 x 3.2 mm; Pins: 28; DatasheetVersion: Aug-15; ComponentLink1Description: Manufacturer URL; RoHSCompliant: true; Radiation Hardening: No; Length: 9.8 mm; Width: 4.5 mm; Supplier 1: LCSC; Supplier Part Number 1: C83312; RoHS: Yes; Category: Crystals; Stock 1: 548; Pricing 1: 1=0.76090, 10=0.57240, 30=0.53830, 100=0.50430, 500=0.48830, 1000=0.48150, 1=0.75930, 10=0.57120, 30=0.53720, 100=0.50330, 500=0.48730, 1000=0.48050, 1=3.90160, 10=2.93540, 30=2.76040, 100=2.58600, 500=2.50400, 1000=2.46910, 1=3.69410, 10=2.77930, 30=2.61360, 100=2.44850, 500=2.37080, 1000=2.33780, 1=0.49670, 10=0.37370, 30=0.35140, 100=0.32920, 500=0.31880, 1000=0.31440, 1=0.42620, 10=0.32060, 30=0.30150, 100=0.28250, 500=0.27350, 1000=0.26970, 1=4.68390, 10=3.52400, 30=3.31380, 100=3.10450, 500=3.00600, 1000=2.96420, 1=63.66850, 10=47.90150, 30=45.04540, 100=42.19970, 500=40.86120, 1000=40.29210, 1=2.44090, 10=1.83640, 30=1.72690, 100=1.61780, 500=1.56650, 1000=1.54470, 1=44.77380, 10=33.68600, 30=31.67740, 100=29.67630, 500=28.73500, 1000=28.33480, 1=4.99360, 10=3.75700, 30=3.53300, 100=3.30980, 500=3.20480, 1000=3.16020, 1=0.79630, 10=0.59910, 30=0.56340, 100=0.52780, 500=0.51110, 1000=0.50390, 1=0.60410, 10=0.45450, 30=0.42740, 100=0.40040, 500=0.38770, 1000=0.38230 (AUD); Case/Package: CSMD; Number of Pins: 4; Frequency: 8MHz; Termination: SMD/SMT; Tolerance: 20ppm; Resistor Type: Ceramic; Series Resistance: 200R; Depth: 3.2mm; Lead Free: Lead Free; ComponentLink3URL: https://datasheet.ciiva.com/15116/getdatasheetpartid-723822-15116857.pdf?src-supplier=Verical; ComponentLink3Description: https://datasheet.ciiva.com/15116/getdatasheetpartid-723822-15116857.pdf?src-supplier=Verical; ComponentLink4URL: https://datasheet.ciiva.com/855/abm3b-855701.pdf?src-supplier=Digi-Key; ComponentLink4Description: https://datasheet.ciiva.com/855/abm3b-855701.pdf?src-supplier=Digi-Key; ComponentLink5URL: https://datasheet.ciiva.com/8344/abm3b-8344389.pdf?src-supplier=Avnet; ComponentLink5Description: https://datasheet.ciiva.com/8344/abm3b-8344389.pdf?src-supplier=Avnet; ComponentLink6URL: https://datasheet.ciiva.com/855/abm3b-855702.pdf?src-supplier=Digi-Key; ComponentLink6Description: https://datasheet.ciiva.com/855/abm3b-855702.pdf?src-supplier=Digi-Key; ComponentLink7URL: https://datasheet.ciiva.com/855/abm3b-855703.pdf?src-supplier=Digi-Key; ComponentLink7Description: https://datasheet.ciiva.com/855/abm3b-855703.pdf?src-supplier=Digi-Key; ComponentLink8URL: https://datasheet.ciiva.com/16216/abm3b-16216600.pdf?src-supplier=Future+Electronics; ComponentLink8Description: https://datasheet.ciiva.com/16216/abm3b-16216600.pdf?src-supplier=Future+Electronics; Supplier 2: Digi-Key; Supplier Part Number 2: 535-9720-1-ND; Stock 2: 114067; Pricing 2: 1=0.95000, 10=0.83900, 50=0.78440, 100=0.69310, 500=0.65664 (USD)
Y2 = CMP-2000-05089-1: Turning Fork Crystal Unit, 32.768 KHz, -40 to 85 degC, 2-Pin SMD, RoHS, Tape and Reel; Manufacturer: Citizen Micro HumanTech; Manufacturer Part Number: CM315D32768DZFT; Package Version: Rev. 1.4, 09/2012; Load Capacitance: 12.5pF; Frequency Tolerance: 20ppm; ESR (Equivalent Series Resistance): 70kR; Package Reference: CM315D-2; Package Description: 2-Pin Surface Mount Device, Body 1.6 x 3.3 mm, Pitch 2.5 mm; Package URL: http://cfm.citizen.co.jp/english/product/pdf/CM315D.pdf; Manufacturer URL: http://www.citizen-systems.com/us/start; Datasheet Version: Rev. 1.4, 09/2012; Datasheet URL: http://cfm.citizen.co.jp/english/product/pdf/CM315D.pdf; Supplier 1: Digi-Key; Supplier Part Number 1: 300-8814-1-ND; RoHS: Yes; Category: Crystals; Stock 1: 29860; Pricing 1: 1=0.72000, 10=0.63800, 50=0.59600, 100=0.52670, 500=0.49896, 1000=0.41580 (USD); Mount: Surface Mount; Case/Package: 1206; Case Code (Metric): 3216; Case Code (Imperial): 1206; Min Operating Temperature: -40°C; Max Operating Temperature: 85°C; Frequency: 32.768kHz; Packaging: Tape and Reel; Package Quantity: 3000; Length: 0.126inch; Height: 0.035inch; Width: 0.059inch; Lead Free: Lead Free; ComponentLink1URL: https://datasheet.ciiva.com/16437/cm315-16437047.pdf?src-supplier=Future+Electronics; ComponentLink1Description: https://datasheet.ciiva.com/16437/cm315-16437047.pdf?src-supplier=Future+Electronics; Supplier 2: LCSC; Supplier Part Number 2: C182057; Stock 2: 48197; Pricing 2: 1=0.31270, 10=0.23190, 30=0.21710, 100=0.20220, 500=0.19560, 1000=0.19230, 1=0.29130, 10=0.21600, 30=0.20220, 100=0.18840, 500=0.18220, 1000=0.17920, 1=1.51960, 10=1.12690, 30=1.05470, 100=0.98260, 500=0.95040, 1000=0.93470, 1=1.42220, 10=1.05470, 30=0.98710, 100=0.91960, 500=0.88960, 1000=0.87480, 1=0.19080, 10=0.14150, 30=0.13240, 100=0.12340, 500=0.11930, 1000=0.11730, 1=0.17100, 10=0.12680, 30=0.11870, 100=0.11060, 500=0.10700, 1000=0.10520, 1=1.66080, 10=1.23160, 30=1.15270, 100=1.07390, 500=1.03880, 1000=1.02150, 1=22.88140, 10=16.96830, 30=15.88110, 100=14.79560, 500=14.31150, 1000=14.07370, 1=0.91740, 10=0.68030, 30=0.63670, 100=0.59320, 500=0.57380, 1000=0.56430, 1=14.94610, 10=11.08370, 30=10.37350, 100=9.66450, 500=9.34830, 1000=9.19290, 1=2.00280, 10=1.48520, 30=1.39010, 100=1.29510, 500=1.25270, 1000=1.23190, 1=0.29890, 10=0.22160, 30=0.20740, 100=0.19330, 500=0.18690, 1000=0.18380, 1=0.21430, 10=0.15892, 30=0.14873, 100=0.13857, 500=0.13403, 1000=0.13181 (AUD)